# EAGLE schematic controller (EAGLE 6.4)
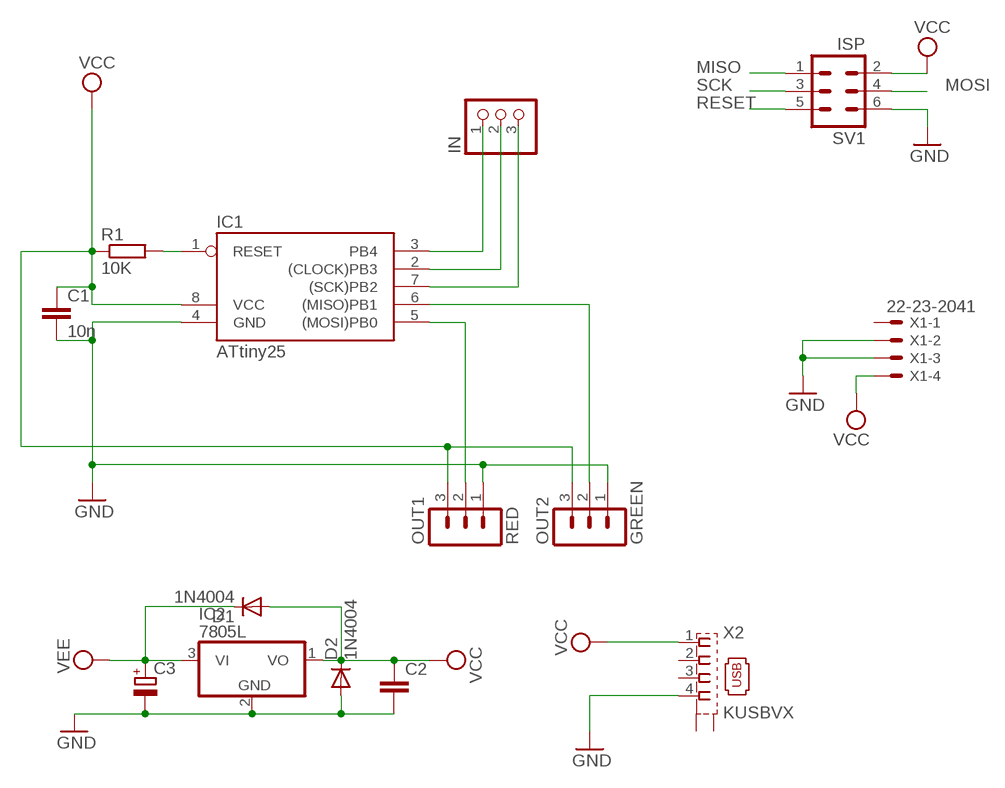
[diagram p0: schematic, sheet 1]

## Parts
C1  10n  C-EU025-024X044  [C025-024X044]
C2  C-EU025-024X044  [C025-024X044]
C3  CPOL-EUE5-4  [E5-4]
D1  1N4004  [DO41-10]
D2  1N4004  [DO41-10]
IC1  ATtiny25  AT90S2343P  [DIL08]
IC2  7805L  [TO92]
IN  PINHD-1X3/90  [1X03/90]
OUT1  RED  MA03-1  [MA03-1]
OUT2  GREEN  MA03-1  [MA03-1]
R1  10K  R-EU_0207/10  [0207/10]
SV1  ISP  MA03-2  [MA03-2]
X1  22-23-2041  [22-23-2041]
X2  KUSBVX  [KUSBVX]

## Nets
GND: C1.2 C2.2 C3.- D2.A IC1.4(GND) IC2.2(GND) OUT1.1 OUT2.1 SV1.6 X1.2 X1.3 X2.4
MISO: IC1.6((MISO)PB1) OUT2.2 SV1.1
MOSI: IC1.5((MOSI)PB0) OUT1.2 SV1.4
N$1: IC1.2((CLOCK)PB3) IN.2
N$2: IC1.3(PB4) IN.1
RESET: IC1.1(RESET) R1.2 SV1.5
SCK: IC1.7((SCK)PB2) IN.3 SV1.3
VCC: C1.1 C2.1 D1.A D2.C IC1.8(VCC) IC2.1(VO) OUT1.3 OUT2.3 R1.1 SV1.2 X1.4 X2.1
VEE: C3.+ D1.C IC2.3(VI)
Unconnected: X1.1 X2.2 X2.3 X2.M1(S1) X2.M2(S2)

## Library data of the parts
C1 C2 = resistor:C-EU: CAPACITOR, European symbol
C3 = resistor:CPOL-EU: POLARIZED CAPACITOR, European symbol
D1 D2 = diode:1N4004: DIODE general purpose rectifier, 1 A
IC1 = atmel:AT90*2343: MICROCONTROLLER 2 Kbytes FLASH 128 bytes SRAM 128 bytes EEPROM; OC_FARNELL: unknown; OC_NEWARK: unknown
IC2 = linear:78*: Positive VOLTAGE REGULATOR Source: http://cache.national.com/ds/LM/LM78L05.pdf http://www.fairchildsemi.com/ds/LM/LM7805.pdf
IN = pinhead:PINHD-1X3: PIN HEADER
OUT1 OUT2 = con-lstb:MA03-1: PIN HEADER; OC_FARNELL: unknown; OC_NEWARK: unknown
R1 = resistor:R-EU_: RESISTOR, European symbol
SV1 = con-lstb:MA03-2: PIN HEADER; OC_FARNELL: unknown; OC_NEWARK: unknown
X1 = con-molex:22-23-2041: .100" (2.54mm) Center Header - 4 Pin; MF: MOLEX; MPN: 22-23-2041; OC_FARNELL: 1462920; OC_NEWARK: 38C0355
X2 = con-kycon:KUSBVX: Vertical,Top Entry Universal Serial Bus Connector KUSBVX Series Source: KYCON Sibalco USB vertical socket KUSBV.pdf